# Altium schematic sheet power.SchDoc
size A
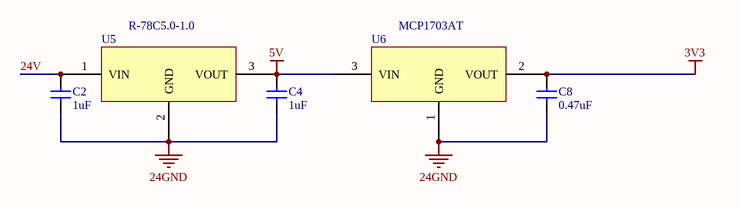
[diagram p0: power.SchDoc]

## Parts
C2  value 1uF  [CAPC1206]  (hidden comment: Cap)
C4  value 1uF  [CAPC1206]  (hidden comment: Cap)
C8  value 0.47uF  [CAPC0603]  (hidden comment: Cap)
U5  R-78C5.0-1.0  [R-78C5.0-1.0]
U6  MCP1703AT  [MCP1703AT-xx02EDB]

## Nets
3V3: C8.1(A) U6.2(VOUT)
5V: C4.1(A) U5.3(VOUT) U6.3(VIN)
24GND: C2.2(B) C4.2(B) C8.2(B) U5.2(GND) U6.1(GND)
24V: C2.1(A) U5.1(VIN)

## Library data of the parts
U5 = R-78C5.0-1.0: CONV DC/DC 1A 5V OUT SIP VERT; Supplier 1: Digi-Key; Supplier Part Number 1: 945-1395-5-ND
U6 = MCP1703AT: 250 mA, 16V, Low Quiescent Current LDO Regulator; Supplier 1: Digi-Key; Supplier Part Number 1: MCP1703AT-3302E/CBCT-ND
C2 C4 C8 = Cap: Supplier 1: Digi-Key; Supplier Part Number 1: 1276-1000-1-ND